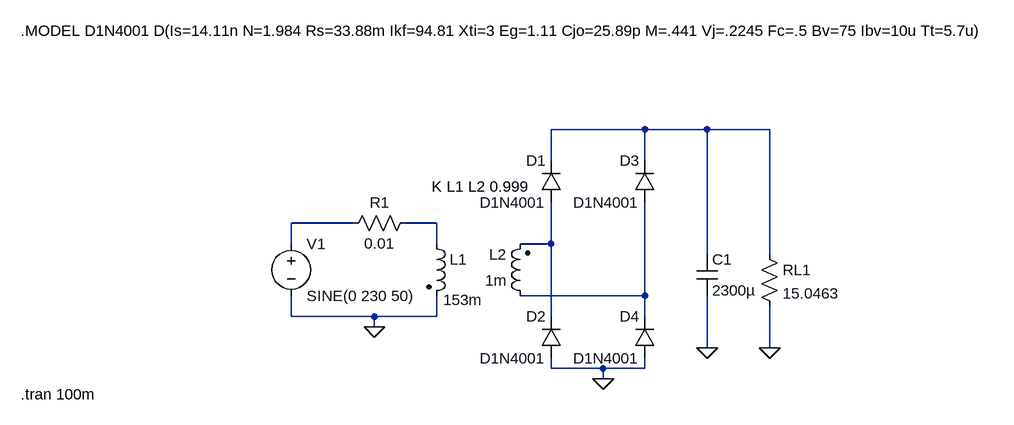
[diagram p0: schematic Redresor.asc]
Redresor.asc, the LTspice schematic file:
Version 4
SHEET 1 2204 736
WIRE 656 -80 512 -80
WIRE 752 -80 656 -80
WIRE 848 -80 752 -80
WIRE 512 -32 512 -80
WIRE 656 -32 656 -80
WIRE 208 64 112 64
WIRE 336 64 288 64
WIRE 112 96 112 64
WIRE 336 96 336 64
WIRE 512 96 512 32
WIRE 512 96 464 96
WIRE 752 112 752 -80
WIRE 848 112 848 -80
WIRE 656 176 656 32
WIRE 656 176 464 176
WIRE 112 208 112 176
WIRE 240 208 112 208
WIRE 336 208 336 176
WIRE 336 208 240 208
WIRE 512 208 512 96
WIRE 656 208 656 176
WIRE 240 224 240 208
WIRE 752 256 752 176
WIRE 848 256 848 192
WIRE 512 288 512 272
WIRE 592 288 512 288
WIRE 656 288 656 272
WIRE 656 288 592 288
WIRE 592 304 592 288
FLAG 592 304 0
FLAG 752 256 0
FLAG 848 256 0
FLAG 240 224 0
SYMBOL voltage 112 80 R0
SYMATTR InstName V1
SYMATTR Value SINE(0 230 50)
SYMBOL res 304 48 R90
WINDOW 0 0 56 VBottom 2
WINDOW 3 32 56 VTop 2
SYMATTR InstName R1
SYMATTR Value 0.01
SYMBOL ind2 320 80 R0
WINDOW 3 26 102 Left 2
SYMATTR Value 153m
SYMATTR InstName L1
SYMATTR Type ind
SYMBOL ind2 480 192 R180
WINDOW 0 36 80 Left 2
WINDOW 3 36 40 Left 2
SYMATTR InstName L2
SYMATTR Value 1m
SYMATTR Type ind
SYMBOL diode 528 32 R180
WINDOW 0 24 64 Left 2
WINDOW 3 24 0 Left 2
SYMATTR InstName D1
SYMATTR Value D1N4001
SYMBOL diode 528 272 R180
WINDOW 0 24 64 Left 2
WINDOW 3 24 0 Left 2
SYMATTR InstName D2
SYMATTR Value D1N4001
SYMBOL diode 672 32 R180
WINDOW 0 24 64 Left 2
WINDOW 3 24 0 Left 2
SYMATTR InstName D3
SYMATTR Value D1N4001
SYMBOL diode 672 272 R180
WINDOW 0 24 64 Left 2
WINDOW 3 24 0 Left 2
SYMATTR InstName D4
SYMATTR Value D1N4001
SYMBOL cap 736 112 R0
SYMATTR InstName C1
SYMATTR Value 2300µ
SYMBOL res 832 96 R0
SYMATTR InstName RL1
SYMATTR Value 15.0463
TEXT 328 8 Left 2 !K L1 L2 0.999
TEXT -304 328 Left 2 !.tran 100m
TEXT -304 -232 Left 2 !.MODEL D1N4001 D(Is=14.11n N=1.984 Rs=33.88m Ikf=94.81 Xti=3 Eg=1.11 Cjo=25.89p M=.441 Vj=.2245 Fc=.5 Bv=75 Ibv=10u Tt=5.7u)

The netlist it stands for:
* Redresor.asc
V1 N002 0 SINE(0 230 50)
R1 N003 N002 0.01
L1 N003 0 153m
L2 N005 N004 1m
D1 N004 N001 D1N4001
D2 0 N004 D1N4001
D3 N005 N001 D1N4001
D4 0 N005 D1N4001
C1 N001 0 2300µ
RL1 N001 0 15.0463
.model D D
.lib standard.dio
K L1 L2 0.999
.tran 100m
.MODEL D1N4001 D(Is=14.11n N=1.984 Rs=33.88m Ikf=94.81 Xti=3 Eg=1.11 Cjo=25.89p M=.441 Vj=.2245 Fc=.5 Bv=75 Ibv=10u Tt=5.7u)
.backanno
.end